# Altium schematic sheet Sheet1.SchDoc
size A4
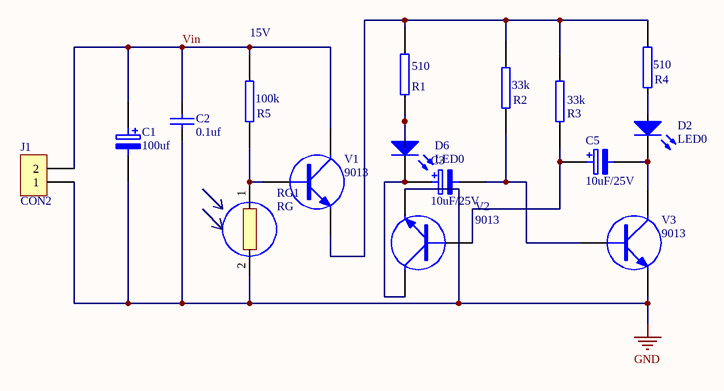
[diagram p0: Sheet1.SchDoc]

## Parts
C1  100uf  [RB5/8]
C2  0.1uf  [RAD4]
C3  10uF/25V  [RB4/5]
C5  10uF/25V  [RB4/5]
D2  LED0  [LED-0]
D6  LED0  [LED-0]
J1  CON2  [HDR1X2]
R1  510  [AXIAL0.4]
R2  33k  [AXIAL0.4]
R3  33k  [AXIAL0.4]
R4  510  [AXIAL0.4]
R5  100k  [AXIAL0.4]
RG1  RG  [RB5/8-D]
V1  9013  [T3-111]
V2  9013  [T3-111]
V3  9013  [T3-111]

## Nets
GND: C1.2 C2.2 J1.1 RG1.2 V2.1(E) V3.1(E)
Vin: C1.1 C2.1 J1.2 R5.2 V1.3(C)
NetC3_1: C3.1 D6.2(K) V2.3(C)
NetC3_2: C3.2 R2.1 V3.2(B)
NetC5_1: C5.1 R3.1 V2.2(B)
NetC5_2: C5.2 D2.2(K) V3.3(C)
NetD2_1: D2.1(A) R4.1
NetD6_1: D6.1(A) R1.1
NetR1_2: R1.2 R2.2 R3.2 R4.2 V1.1(E)
NetR5_1: R5.1 RG1.1 V1.2(B)

## Notes on the sheet
- (near R5) 15V

## Library data of the parts
C1 = ELECTRO2: Electrolytic Capacitor
C2 = CAP: Capacitor
C3 C5 = ELECTRO2_1: Electrolytic Capacitor
D2 D6 = LED0: Typical INFRARED GaAs LED; Published: 8-Jun-2000; LatestRevisionDate: 08-Jul-2005; LatestRevisionNote: Mech Layer 1 removed.; PackageReference: LED-0; Publisher: Altium Limited; PackageDescription: LED; 2 Leads
J1 = CON2_5: Connector
R1-R5 = RES2
V1-V3 = NPN_111: NPN Transistor